# EAGLE design jndis_v1.1 (EAGLE 5.11)
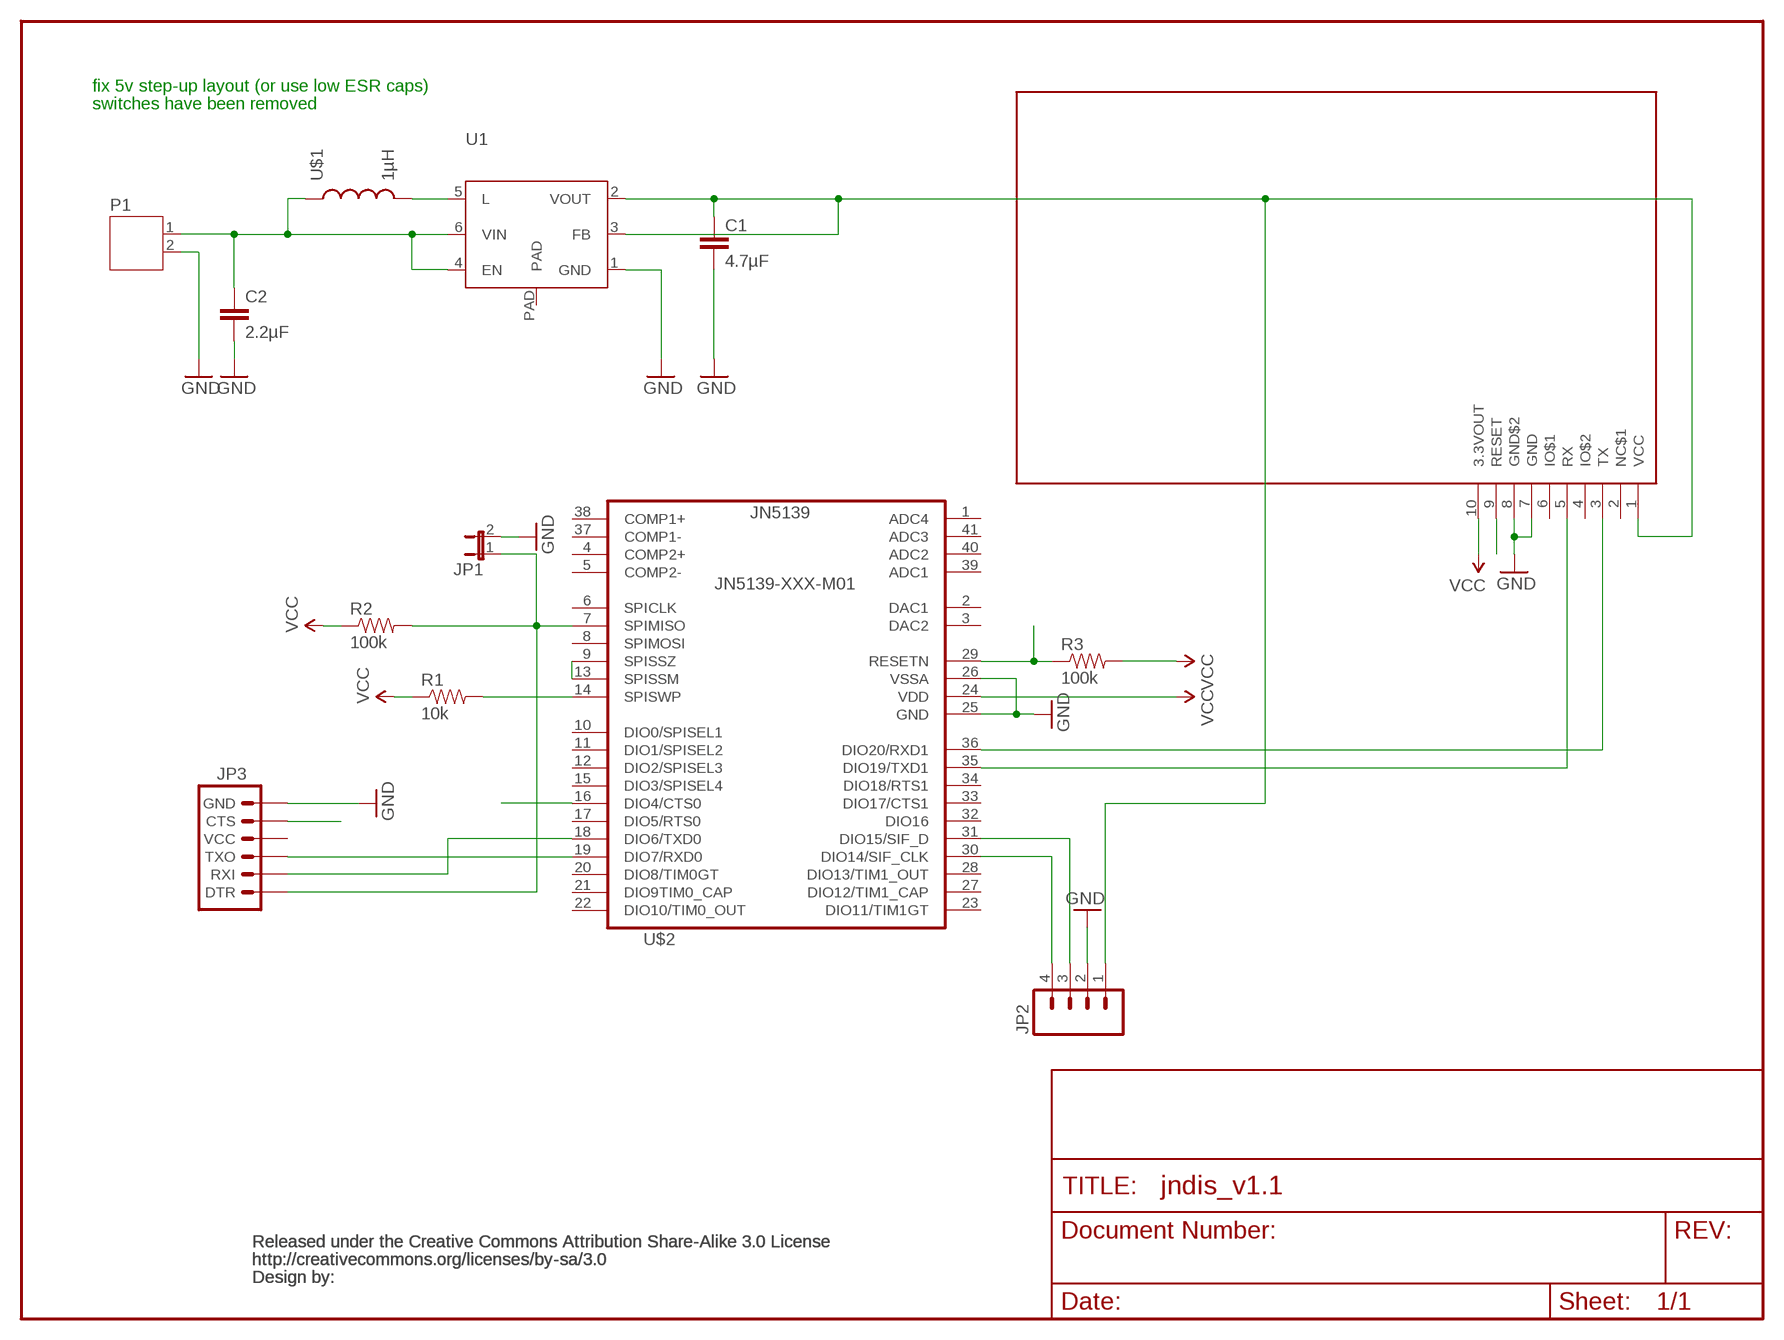
[diagram p0: schematic, sheet 1]

## Parts
C1  4.7µF  CAP0603-CAP  [0603-CAP]
C2  2.2µF  CAP0603-CAP  [0603-CAP]
JP1  JUMPER-2PTH  [1X02]
JP2  M04LOCK  [1X04_LOCK]
JP3  ARDUINO_SERIAL_PROGRAMPTH  [1X06]
P1  JST-PH2  [JST-PH2]
R1  10k  RESISTOR  [0805]
R2  100k  RESISTOR  [0805]
R3  100k  RESISTOR  [0805]
U1  TPS61240-QFN  [QFN_6_PAD]
U$1  1µH  INDUCTOR0603  [0603]
U$2  JN5139-XXX-M01  [JN5139-XXX-MO0]
U$3  UOLED  [UOLED160]
U$4  CREATIVE_COMMONS  [CREATIVE_COMMONS]
U$5  CREATIVE_COMMONS  [CREATIVE_COMMONS]
U$6  CREATIVE_COMMONS  [CREATIVE_COMMONS]

## Nets
GND: C1.2 C2.2 JP1.2 JP2.2 JP3.6(GND) P1.2 U1.1(GND) U$2.25(GND) U$2.26(VSSA) U$3.7(GND) U$3.8(GND$2)
N$1: C2.1 P1.1 U1.4(EN) U1.6(VIN) U$1.1
N$2: JP3.3(TXO) U$2.19(DIO7/RXD0)
N$3: C1.1 JP2.1 U1.2(VOUT) U1.3(FB) U$3.1(VCC)
N$4: U1.5(L) U$1.2
N$6: U$2.36(DIO20/RXD1) U$3.3(TX)
N$7: JP3.2(RXI) U$2.18(DIO6/TXD0)
N$8: R1.2 U$2.14(SPISWP)
N$9: U$2.9(SPISSZ) U$2.13(SPISSM)
N$10: JP2.4 U$2.30(DIO14/SIF_CLK)
N$13: JP2.3 U$2.31(DIO15/SIF_D)
N$14: U$2.35(DIO19/TXD1) U$3.5(RX)
RESETDISPLAY: U$2.16(DIO4/CTS0) U$3.9(RESET)
RESETN: JP3.5(CTS) R3.1 U$2.29(RESETN)
SPIMISO: JP1.1 JP3.1(DTR) R2.2 U$2.7(SPIMISO)
VCC: R1.1 R2.1 R3.2 U$2.24(VDD) U$3.10(3.3VOUT)
Unconnected: JP3.4(VCC) U1.PAD U$2.1(ADC4) U$2.2(DAC1) U$2.3(DAC2) U$2.4(COMP2+) U$2.5(COMP2-) U$2.6(SPICLK) U$2.8(SPIMOSI) U$2.10(DIO0/SPISEL1) U$2.11(DIO1/SPISEL2) U$2.12(DIO2/SPISEL3) U$2.15(DIO3/SPISEL4) U$2.17(DIO5/RTS0) U$2.20(DIO8/TIM0GT) U$2.21(DIO9TIM0_CAP) U$2.22(DIO10/TIM0_OUT) U$2.23(DIO11/TIM1GT) U$2.27(DIO12/TIM1_CAP) U$2.28(DIO13/TIM1_OUT) U$2.32(DIO16) U$2.33(DIO17/CTS1) U$2.34(DIO18/RTS1) U$2.37(COMP1-) U$2.38(COMP1+) U$2.39(ADC1) U$2.40(ADC2) U$2.41(ADC3) U$3.2(NC$1) U$3.4(IO$2) U$3.6(IO$1)

## Notes on the sheet
- fix 5v step-up layout (or use low ESR caps)
- switches have been removed

## Library data of the parts
C1 C2 = SparkFun:CAP: Capacitor Standard 0603 ceramic capacitor, and 0.1" leaded capacitor.
JP1 = SparkFun:JUMPER-2: Jumper Basic 0.1" spaced jumper. Use with breakaway headers.
JP2 = SparkFun:M04: Header 4 Standard 4-pin 0.1" header. Use with straight break away headers (SKU : PRT-00116), right angle break away headers (PRT-00553), swiss pins (PRT-00743), machine pins (PRT-00117), and female headers (PRT-00115). Molex polarized connector foot print use with SKU : PRT-08231 with associated crimp pins and housings.
JP3 = SparkFun:ARDUINO_SERIAL_PROGRAM
P1 = jst-ph:JST-PH2
R1-R3 = SparkFun:RESISTOR: Resistor Basic schematic elements and footprints for 0603, 1206, and PTH 1/10th watt (small) resistors.
U1 = CH_TI:TPS61240
U$1 = SparkFun:INDUCTOR: Inductors Basic Inductor/Choke - 0603 and 1206. Footprints are not proven and vary greatly between part numbers.
U$2 = jennic:JN5139-XXX-M01: JN5139-xxx-M00xxx, Farnell: 1500175
U$3 = 4dsystems2:UOLED
U$4-U$6 = SparkFun:CREATIVE_COMMONS

## Board
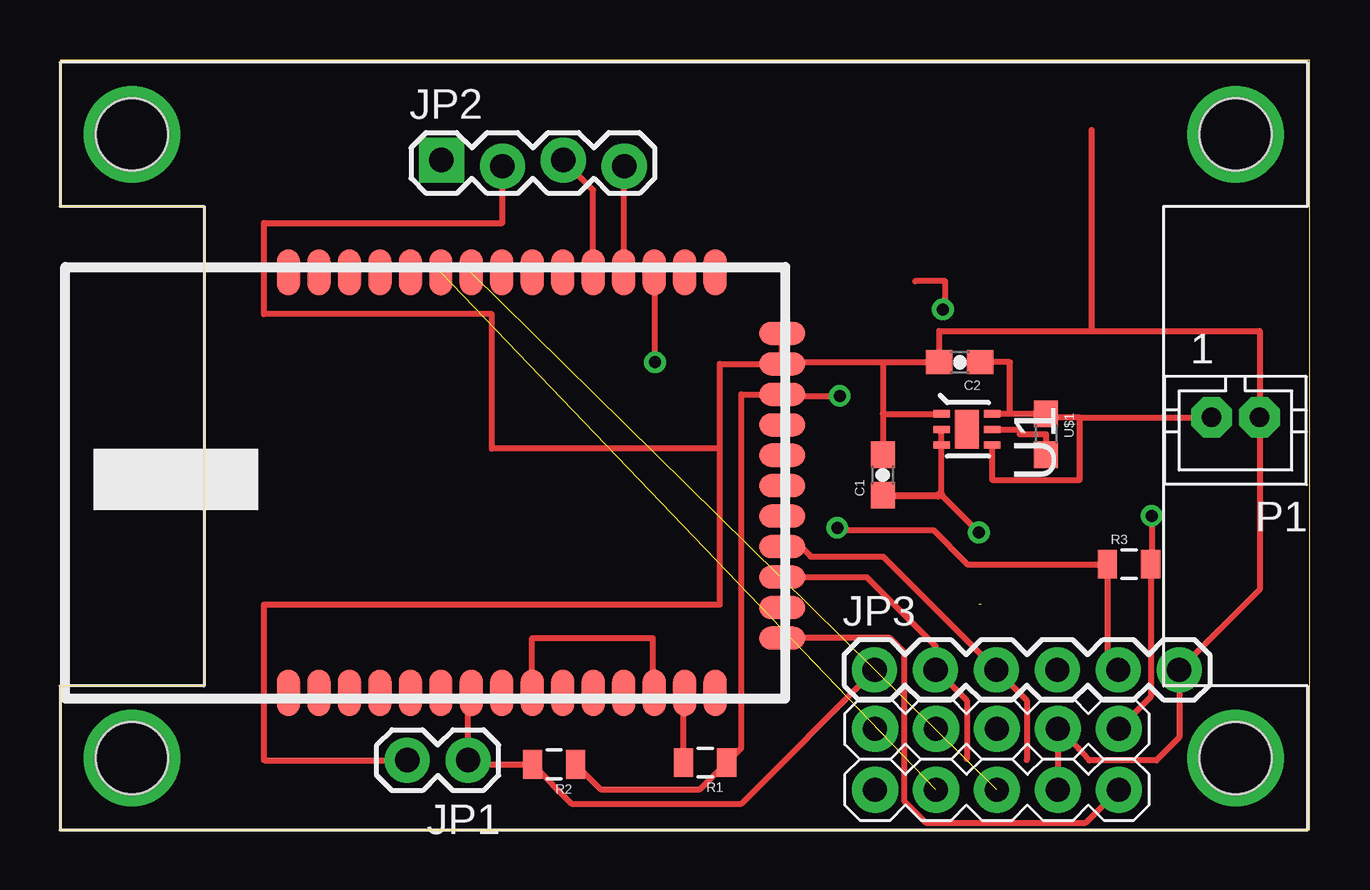
[diagram p1: board, top side]
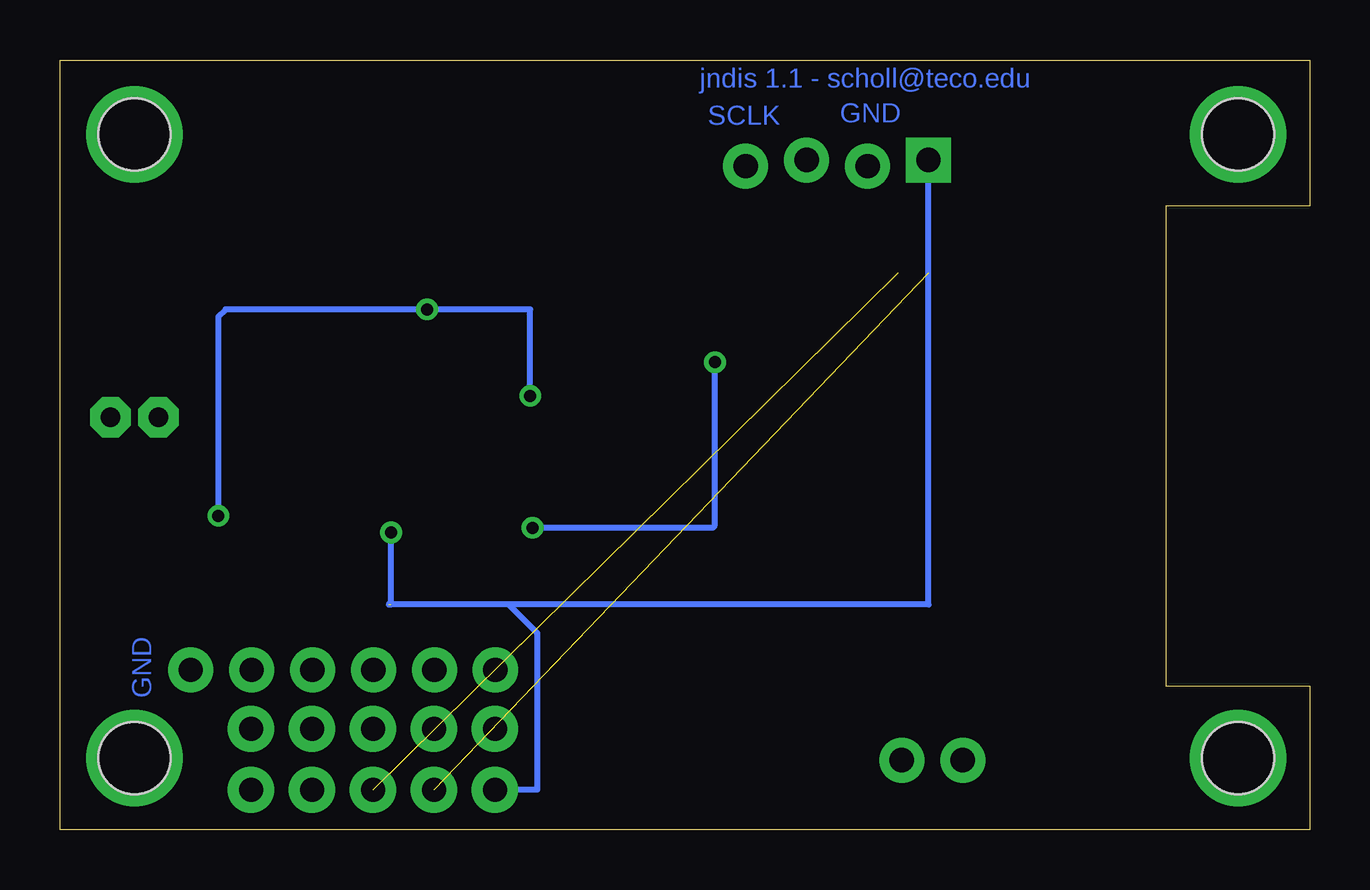
[diagram p2: board, bottom side, seen from below]

Size 52.1 x 32.1 mm. Coordinates in mm from the lower left corner, seen from the top.
Outline: 52.1,0 52.1,32.1 0,32.1 0,26 6,26 6,6 0,6 0,0 52.1,0
Copper layers (1*16): Top 0.035mm / dielectric 1.5mm / Bottom 0.035mm
Design rules "default": minimum track width 10mil, minimum drill 24mil, track to track 8mil, track to pad 8mil, pad to pad 8mil, via to via 8mil, smd to smd 8mil, copper to edge 40mil, drill to drill 8mil, minimum pad ring 10mil, minimum via ring 8mil, stop-mask expansion 4mil, vias tented up to drill 0mil, thermal gap 10mil

### Footprints (pad centres in the part's own frame; a part is rotated, then mirrored left to right if it is on the bottom)
0603-CAP = smd 1.1 x 1: 1 -0.85,0; 2 0.85,0
1X02 = drill 1.016 pad 1.88 round: 1 0,0; 2 2.54,0
1X04_LOCK = drill 1.016 pad 1.88 square: 1 0,0.127 | drill 1.016 pad 1.88 round: 2 2.54,-0.127; 3 5.08,0.127; 4 7.62,-0.127
1X06 = drill 1.016 pad 1.88 round: 1 0,0; 2 2.54,0; 3 5.08,0; 4 7.62,0; 5 10.16,0; 6 12.7,0
JST-PH2 = drill 0.813 pad 1.676 octagon: 1 1,0; 2 -1,0
0805 = smd 0.8 x 1.2: 1 -0.9,0; 2 0.9,0
QFN_6_PAD = smd 0.3 x 0.69: 1 -0.65,-1.056; 2 0,-1.056; 3 0.65,-1.056; 4 0.65,1.056; 5 0,1.056; 6 -0.65,1.056 | smd 1.6 x 1: PAD 0,0
0603 = smd 1.1 x 1: 1 -0.85,0; 2 0.85,0
JN5139-XXX-MO0 = smd 1.93 x 0.965: 1 0,0; 2 0,-1.27; 3 0,-2.54; 4 0,-3.81; 5 0,-5.08; 6 0,-6.35; 7 0,-7.62; 8 0,-8.89; 9 0,-10.16; 10 0,-11.43; 11 0,-12.7; 12 0,-13.97; 13 0,-15.24; 14 0,-16.51; 15 0,-17.78; 27 17.526,-17.78; 28 17.526,-16.51; 29 17.526,-15.24; 30 17.526,-13.97; 31 17.526,-12.7; 32 17.526,-11.43; 33 17.526,-10.16; 34 17.526,-8.89; 35 17.526,-7.62; 36 17.526,-6.35; 37 17.526,-5.08; 38 17.526,-3.81; 39 17.526,-2.54; 40 17.526,-1.27; 41 17.526,0 | smd 0.965 x 1.93: 16 2.286,-20.574; 17 3.556,-20.574; 18 4.826,-20.574; 19 6.096,-20.574; 20 7.366,-20.574; 21 8.636,-20.574; 22 9.906,-20.574; 23 11.176,-20.574; 24 12.446,-20.574; 25 13.716,-20.574; 26 14.986,-20.574
UOLED160 = drill 1 pad 1.93 round: 1 33.975,1.675; 2 33.975,4.215; 3 36.515,1.675; 4 36.515,4.215; 5 39.055,1.675; 6 39.055,4.215; 7 41.595,1.675; 8 41.595,4.215; 9 44.135,1.675; 10 44.135,4.215 | drill 3 round: P$1 3,3; P$2 3,29; P$3 49,29; P$4 49,3 | hole 3: 3,3; 3,29; 49,3; 49,29

### Placement (x,y rotation side)
C1  34.3,14.8 90 top
C2  37.5,19.5 180 top
JP1  17.01,2.91 180 top
JP2  15.9,27.8 0 top
JP3  33.95,6.67 0 top
P1  49,17.2 180 top
R1  26.89,2.81 180 top
R2  20.59,2.73 180 top
R3  44.56,11.08 0 top
U1  37.8,16.7 270 top
U$1  41.1,16.5 270 top
U$2  9.53,5.71 90 top
U$3  0,0 0 top
U$4  20.4,-9.3 0 top  (outside the outline)
U$5  20.4,-19.2 0 top  (outside the outline)
U$6  20.4,-29.1 0 top  (outside the outline)

### Tracks (layer width: path | path; a pad name or v marks a point on that pad's centre or on a via)
GND
  Top 0.254: U$3.7 U$3.8 41.69,4.21 42.9,2.9 45.7,2.9 46.65,3.85 JP3.6 50,10.02 P1.2 50,20.8 43,20.8 | JP1.2 8.5,2.91 8.5,9.4 27.5,9.4 27.5,15.9 | U$2.25 27.5,19.43 27.5,15.9 | U$2.25 U$2.26 | 43,20.8 36.65,20.8 C2.2 34.3,19.5 | 34.3,19.5 30.1,19.5 U$2.25 | 34.3,17.35 C1.2 | 34.3,17.35 U1.1 | 34.3,19.5 34.3,17.35 | 43,20.8 43,29.18 | JP2.2 18.44,25.3 8.5,25.3 8.5,21.5 18,21.5 18,15.9 27.5,15.9
N$1
  Top 0.254: 42.5,17.2 41.1,17.2 U$1.1 39.6,17.35 | 39.6,17.35 U1.6 | U1.4 38.86,14.6 42.5,14.6 42.5,17.2 | C2.1 39.6,19.5 39.6,17.35 | P1.1 42.51,17.2 42.5,17.2
N$2
  Top 0.254: 40.3,2.92 40.3,5.4 JP3.3 34.3,11.4 31.3,11.4 30.89,11.81 U$2.19
N$3  (via drill 0.5 pad 0.25)  (1 unrouted)
  Top 0.254: U1.2 U1.3 36.74,13.95 C1.1 | C1.1 34.3,13.9 36.6,13.9 36.6,14 36.7,14 36.8,13.9 | C1.1 36.8,13.95 36.8,13.9 | v38.3,12.4 36.8,13.9
  Bottom 0.254: U$3.1 32.2,1.68 32.2,8.2 33.4,9.4 38.3,9.4 v38.3,12.4 | 38.3,9.5 38.4,9.4 15.9,9.4 JP2.1
N$4
  Top 0.254: U$1.2 41.1,16.5 40,16.5 40,16.7 U1.5
N$6  (1 unrouted)
N$7
  Top 0.254: 37.8,2.96 37.8,5.4 36.53,6.67 JP3.2 36.49,7.67 33.62,10.54 U$2.18
N$8
  Top 0.254: R1.2 25.99,5.67 U$2.14
N$9
  Top 0.254: U$2.9 19.68,8 24.7,8 24.7,5.71 U$2.13
N$10
  Top 0.254: U$2.30 23.52,23.27 JP2.4
N$13
  Top 0.254: U$2.31 22.23,26.68 JP2.3
N$14  (1 unrouted)
RESETDISPLAY
  Top 0.254: U$2.16 34.6,8 35.2,7.4 35.2,1.2 36.1,0.3 42.76,0.3 U$3.9
RESETN  (via drill 0.5 pad 0.25)
  Top 0.254: U$2.29 24.77,22.64 24.8,22.6 v24.8,19.5 | JP3.5 43.66,7.12 R3.1 37.82,11.08 36.4,12.5 32.5,12.5 v32.4,12.6
  Bottom 0.254: v32.4,12.6 24.9,12.6 24.8,12.7 v24.8,19.5
SPIMISO
  Top 0.254: JP3.1 33.95,6.65 28.4,1.1 21.32,1.1 R2.2 17.19,2.73 JP1.1 17.01,5.58 U$2.7
VCC  (via drill 0.5 pad 0.25)
  Top 0.254: R2.1 22.52,1.7 26.68,1.7 R1.1 28.4,3.42 28.4,18.16 U$2.24 30.16,18.1 v32.5,18.1 | U$3.10 45.46,5.54 R3.2 45.5,11.12 v45.5,13.1 | 35.66,22.88 36.9,22.88 36.9,21.8 v36.8,21.7
  Bottom 0.254: v45.5,13.1 45.5,21.4 45.2,21.7 v36.8,21.7 32.5,21.7 v32.5,18.1

### Text on the board
Bottom: jndis 1.1 - scholl@teco.edu | GND | SCLK | GND